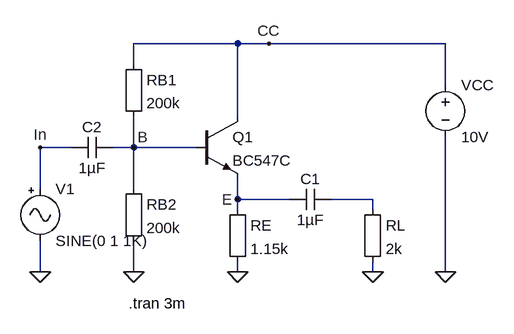
[diagram p0: schematic circuit3b.asc]
circuit3b.asc, the LTspice schematic file:
Version 4
SHEET 1 880 680
WIRE 256 16 96 16
WIRE 304 16 256 16
WIRE 576 16 304 16
WIRE 96 48 96 16
WIRE 576 80 576 16
WIRE 256 128 256 16
WIRE 0 176 -48 176
WIRE 96 176 96 128
WIRE 96 176 64 176
WIRE 192 176 96 176
WIRE -48 240 -48 176
WIRE 96 240 96 176
WIRE 256 256 256 224
WIRE 336 256 256 256
WIRE 464 256 400 256
WIRE 256 272 256 256
WIRE 464 272 464 256
WIRE -48 368 -48 320
WIRE 96 368 96 320
WIRE 256 368 256 352
WIRE 464 368 464 352
WIRE 576 368 576 160
FLAG 576 368 0
FLAG 96 176 B
FLAG 256 256 E
FLAG 304 16 CC
FLAG 256 368 0
FLAG -48 368 0
FLAG -48 176 In
FLAG 464 368 0
FLAG 96 368 0
DATAFLAG 304 256 "round($*1000)/1000"
DATAFLAG 144 176 "round($*1k)/1k"
SYMBOL npn 192 128 R0
SYMATTR InstName Q1
SYMATTR Value BC547C
SYMBOL Misc\\EuropeanResistor 240 256 R0
SYMATTR InstName RE
SYMATTR Value 1.15k
SYMBOL Misc\\EuropeanResistor 80 32 R0
SYMATTR InstName RB1
SYMATTR Value 200k
SYMBOL voltage 576 64 R0
WINDOW 123 0 0 Left 0
WINDOW 39 0 0 Left 0
SYMATTR InstName VCC
SYMATTR Value 10V
SYMBOL cap 64 160 R90
WINDOW 0 0 32 VBottom 2
WINDOW 3 32 32 VTop 2
SYMATTR InstName C2
SYMATTR Value 1µF
SYMBOL Misc\\signal -48 224 R0
SYMATTR InstName V1
SYMBOL Misc\\EuropeanResistor 448 256 R0
SYMATTR InstName RL
SYMATTR Value 2k
SYMBOL cap 400 240 R90
WINDOW 0 0 32 VBottom 2
WINDOW 3 32 32 VTop 2
SYMATTR InstName C1
SYMATTR Value 1µF
SYMBOL Misc\\EuropeanResistor 80 224 R0
SYMATTR InstName RB2
SYMATTR Value 200k
TEXT 88 416 Left 2 !.tran 3m

The netlist it stands for:
* circuit3b.asc
Q1 CC B E 0 BC547C
RE E 0 1.15k
RB1 CC B 200k
VCC CC 0 10V
C2 B In 1µF
V1 In 0 SINE(0 1 1K)
RL N001 0 2k
C1 N001 E 1µF
RB2 B 0 200k
.model NPN NPN
.model PNP PNP
.lib standard.bjt
.tran 3m
.backanno
.end